# EAGLE design board (EAGLE 7.6.0)
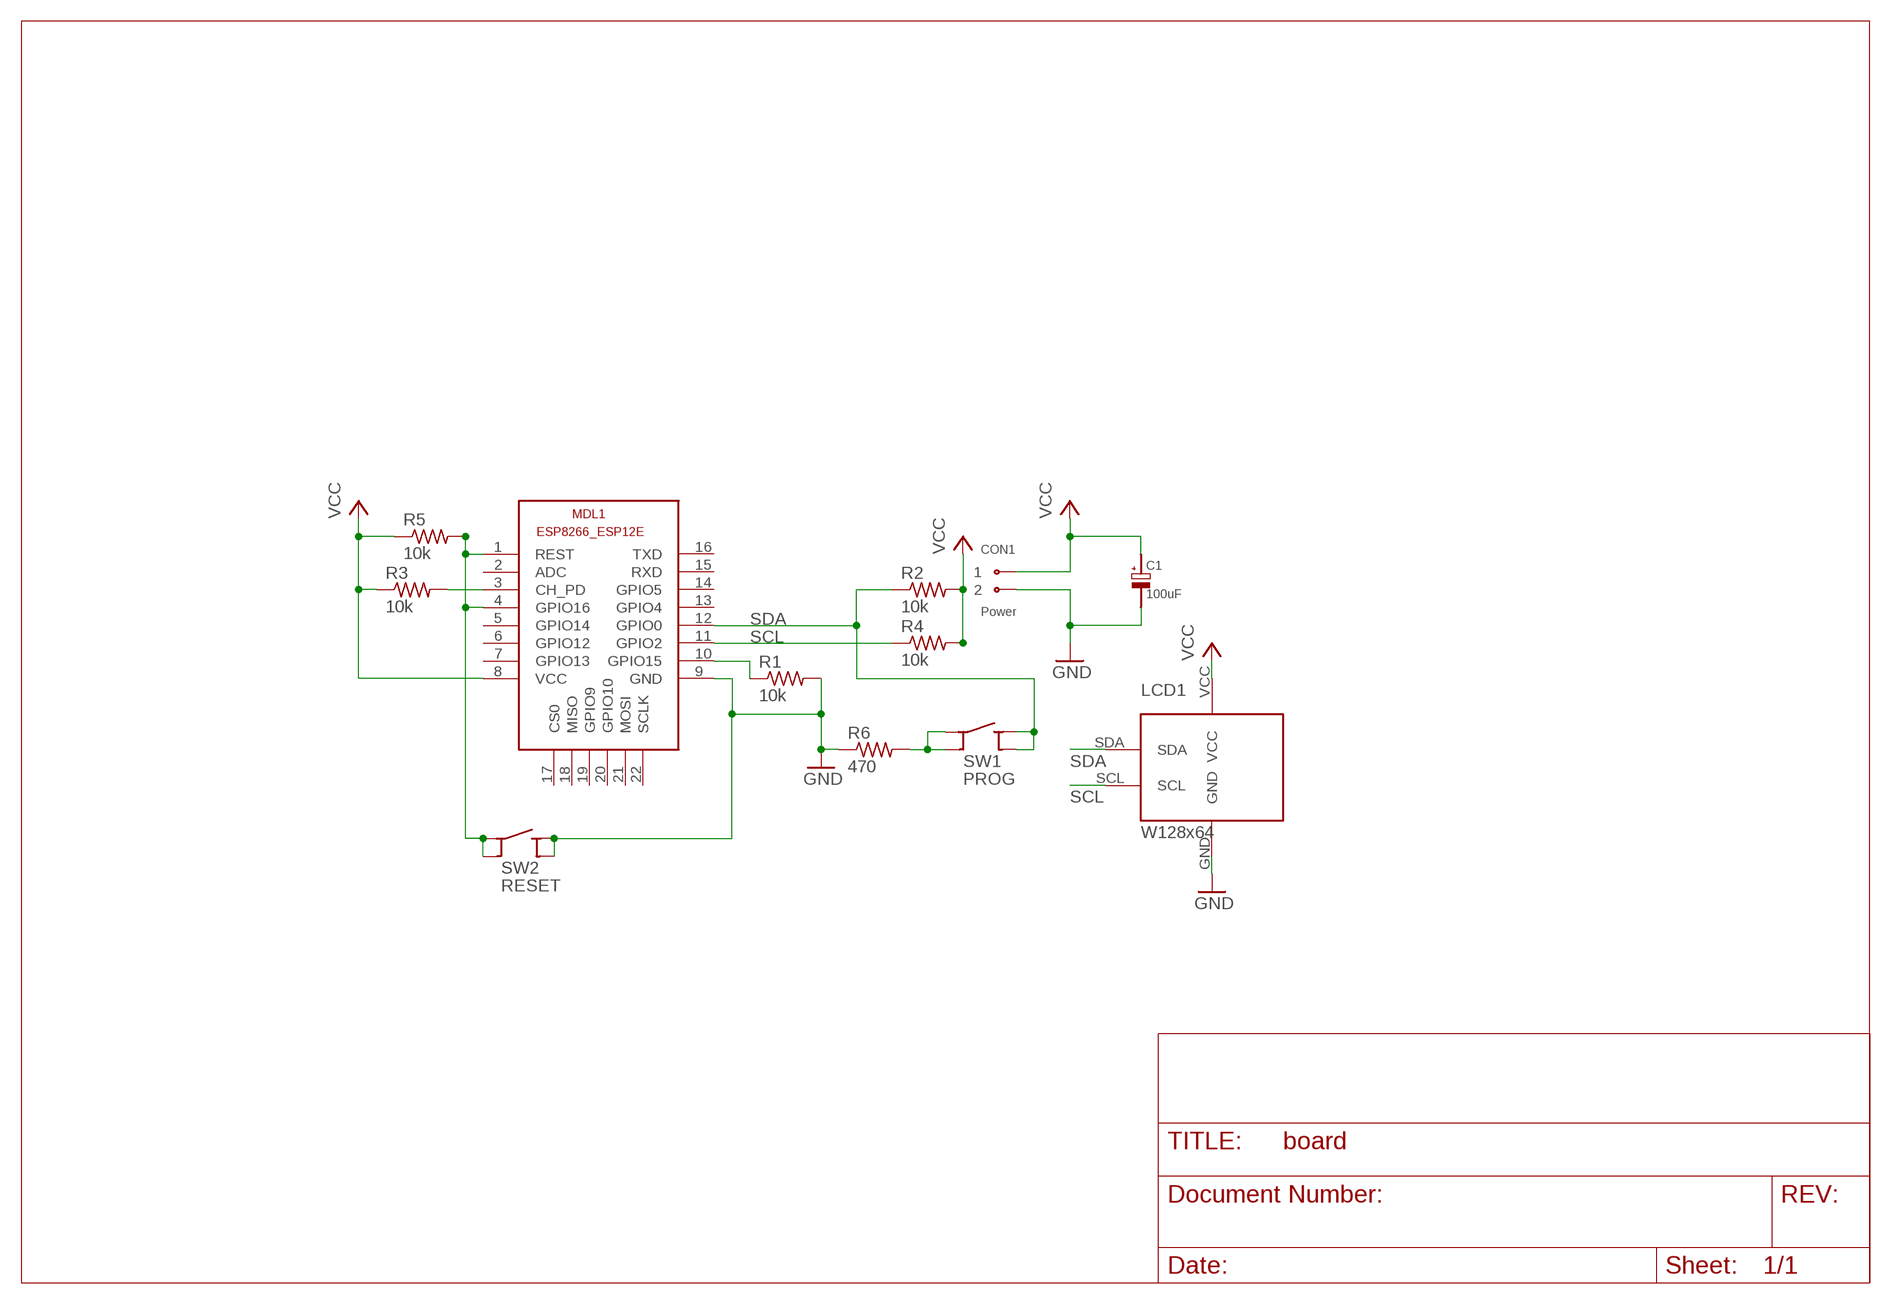
[diagram p0: schematic, sheet 1]

## Parts
C1  100uF  CPOLTANT02  [POLTANT02]
CON1  Power  CON-1X2WEID-PCB  [CON-WEID-PCB2]
LCD1  W128x64  OLED_64X128  [OLED_SMALL_I2C]
MDL1  ESP8266  ESP8266-12EESP8266-ESP12E  [ESP8266-ESP12E]
R1  10k  R-US_R0805  [R0805]
R2  10k  R-US_R0805  [R0805]
R3  10k  R-US_R0805  [R0805]
R4  10k  R-US_R0805  [R0805]
R5  10k  R-US_R0805  [R0805]
R6  470  R-US_R0805  [R0805]
SW1  PROG  SWITCH-PUSHBUTTONJAYCAR  [SWITCH-SPST-MOMENTARY]
SW2  RESET  SWITCH-PUSHBUTTONJAYCAR  [SWITCH-SPST-MOMENTARY]

## Nets
GND: C1.MINUS(NEGATIVE) CON1.2 LCD1.GND MDL1.9(GND) R1.2 R6.1 SW2.P$3 SW2.P$4
N$1: MDL1.10(GPIO15) R1.1
N$3: MDL1.3(CH_PD) R3.2
N$5: MDL1.1(REST) MDL1.4(GPIO16) R5.2 SW2.P$1 SW2.P$2
N$7: R6.2 SW1.P$1 SW1.P$2
SCL: LCD1.SCL MDL1.11(GPIO2) R4.1
SDA: LCD1.SDA MDL1.12(GPIO0) R2.1 SW1.P$3 SW1.P$4
VCC: C1.PLUS(POSITIVE) CON1.1 LCD1.VCC MDL1.8(VCC) R2.2 R3.1 R4.2 R5.1
Unconnected: MDL1.2(ADC) MDL1.5(GPIO14) MDL1.6(GPIO12) MDL1.7(GPIO13) MDL1.13(GPIO4) MDL1.14(GPIO5) MDL1.15(RXD) MDL1.16(TXD) MDL1.17(CS0) MDL1.18(MISO) MDL1.19(GPIO9) MDL1.20(GPIO10) MDL1.21(MOSI) MDL1.22(SCLK)

## Library data of the parts
C1 = steves:CPOL
CON1 = steves:CON-1X2
LCD1 = my_lib:OLED_64X128
MDL1 = ESP12E:ESP8266-12E: ESP8266-12E with additional I/O and GPIO04/05 corrected The author cannot warrant that this library is free from error or will meet your specific requirements. Created by PuceBaboon.com. Komagane, Nagano, JAPAN
R1-R6 = resistor:R-US_: RESISTOR, American symbol
SW1 SW2 = steves:SWITCH-PUSHBUTTON

## Board
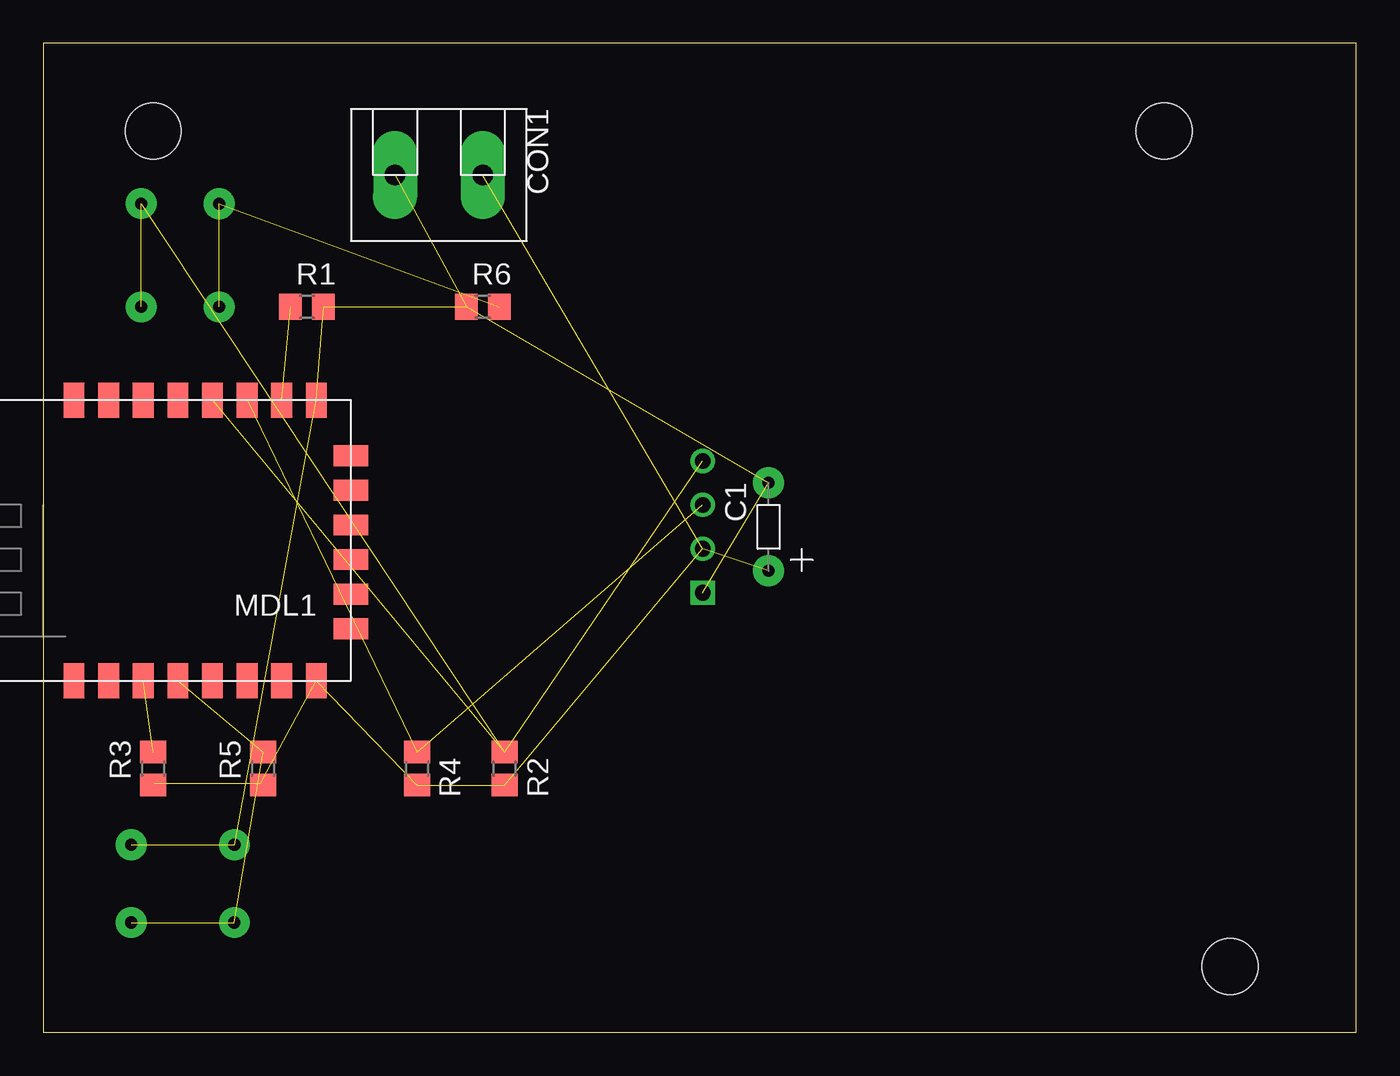
[diagram p1: board, top side]
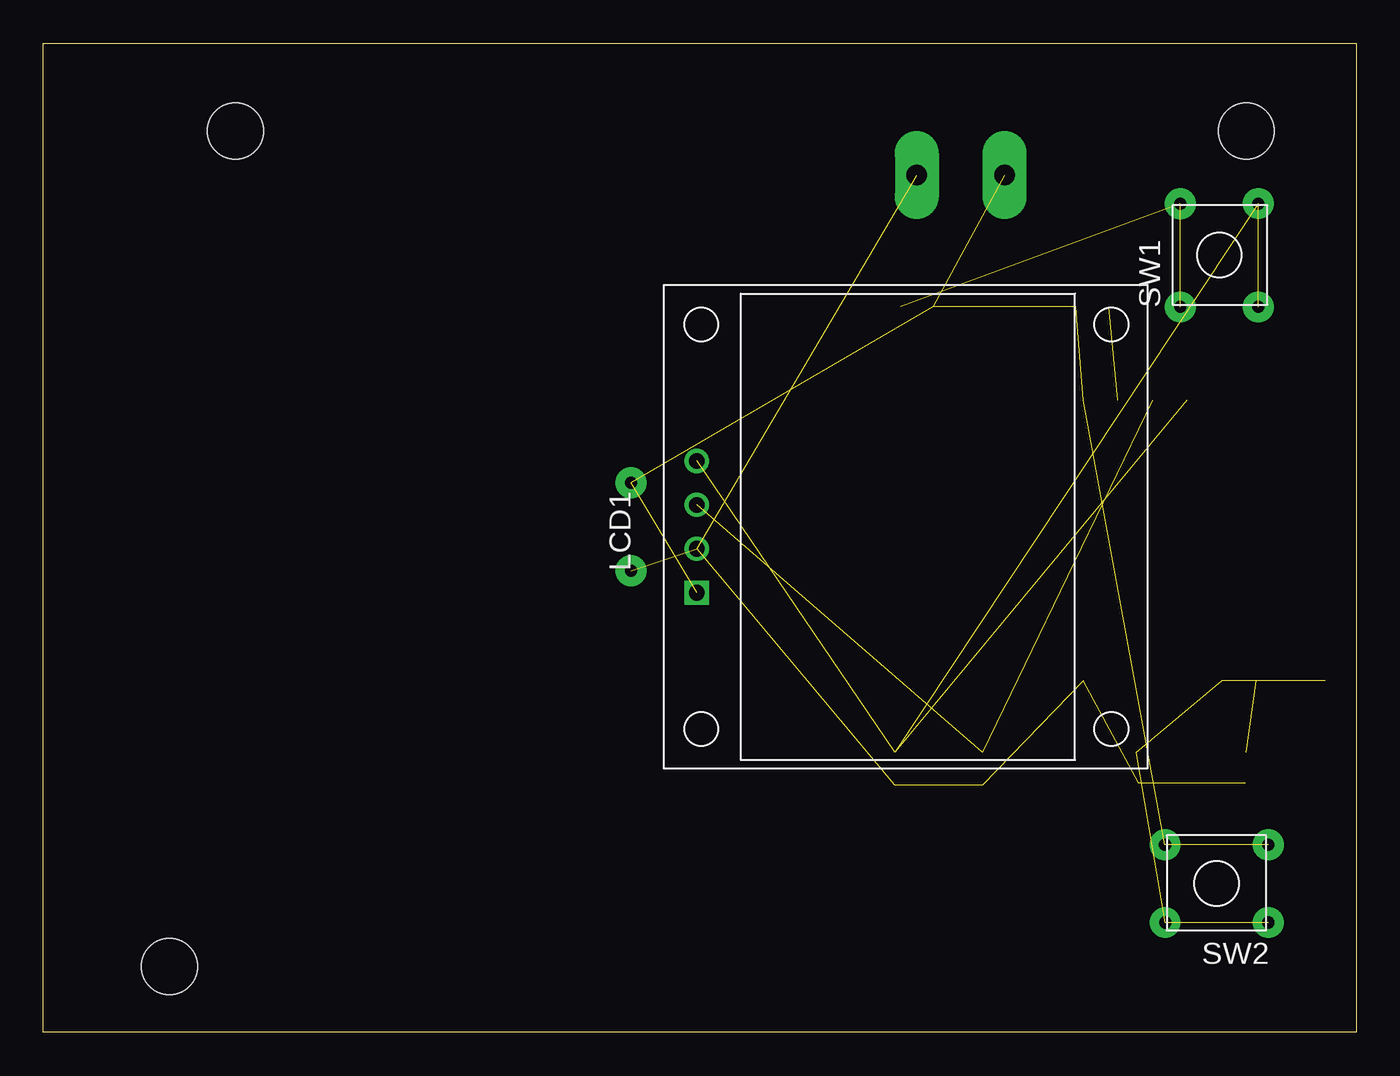
[diagram p2: board, bottom side, seen from below]

Size 75.87 x 57.14 mm. Coordinates in mm from the lower left corner, seen from the top.
Outline: 0,0 75.87,0 75.87,57.14 0,57.14 0,0
Copper layers (1*16): Top 0.035mm / dielectric 1.5mm / Bottom 0.035mm
Design rules "default": minimum track width 10mil, minimum drill 24mil, track to track 8mil, track to pad 8mil, pad to pad 8mil, via to via 8mil, smd to smd 8mil, copper to edge 40mil, drill to drill 8mil, minimum pad ring 10mil, minimum via ring 8mil, stop-mask expansion 4mil, vias tented up to drill 0mil, thermal gap 10mil
Holes 3.2 mm at 68.58,3.81 64.77,52.07 6.35,52.07

### Footprints (pad centres in the part's own frame; a part is rotated, then mirrored left to right if it is on the bottom)
POLTANT02 = drill 0.7 pad 1.778: MINUS -2.54,0; PLUS 2.54,0
CON-WEID-PCB2 = drill 1.2 pad 2.54 long: 1 0,5.08; 2 0,0
OLED_SMALL_I2C = drill 0.9 square: GND 0,0 | drill 0.9: SCL 5.08,0; SDA 7.62,0; VCC 2.54,0
ESP8266-ESP12E = smd 2 x 1.2: 1 0,16; 2 0,14; 3 0,12; 4 0,10; 5 0,8; 6 0,6; 7 0,4; 8 0,2; 9 16.2,2; 10 16.2,4; 11 16.2,6; 12 16.2,8; 13 16.2,10; 14 16.2,12; 15 16.2,14; 16 16.2,16 | smd 1.2 x 2: 17 11,0; 18 3,0; 19 5,0; 20 13,0; 21 7,0; 22 9,0
R0805 = smd 1.3 x 1.5: 1 -0.95,0; 2 0.95,0
SWITCH-SPST-MOMENTARY = drill 0.7 pad 1.778: P$1 0,5.961; P$2 0,0; P$3 4.494,5.969; P$4 4.496,0

### Placement (x,y rotation side)
C1  41.91,29.21 270 top
CON1  20.32,49.53 270 top
LCD1  38.1,25.4 90 bottom
MDL1  17.78,20.32 90 top
R1  15.24,41.91 0 top
R2  26.67,15.24 270 top
R3  6.35,15.24 90 top
R4  21.59,15.24 270 top
R5  12.7,15.24 90 top
R6  25.4,41.91 0 top
SW1  10.16,41.91 0 bottom
SW2  5.08,6.35 90 bottom

### Tracks (layer width: path | path; a pad name or v marks a point on that pad's centre or on a via)
GND  (7 unrouted)
N$1  (1 unrouted)
N$3  (1 unrouted)
N$5  (4 unrouted)
N$7  (2 unrouted)
SCL  (2 unrouted)
SDA  (4 unrouted)
VCC  (7 unrouted)
  Top 0.254: 6.4,14.4 R3.1 | 12.57,14.4 R5.1